# Altium schematic sheet SAMV71_Xplained_Ultra_Audio.SchDoc: Audio
size A3; Organization: Microchip Norway; Address1: Vestre Rosten 79; Address2: N-7075 TILLER; Address3: NORWAY; DocumentNumber: A09-2407; Revision: 12; SheetNumber: 11; SheetTotal: 13; DrawnBy: Microchip Norway; Engineer: AH; PageSetup: Record=PageOptions|CenterHorizontal=True|CenterVertical=True|PrintScale=1.01|XCorrection=1.00|YCorrection=1.00|PrintKind=1|BorderSize=5000000|LeftOffset=0|BottomOffset=0|Orientation=2|PaperLength=1000|PaperWidth=1000|Scale=100|PaperSource=7|PrintQuality=-4|MediaType=1|DitherType=10|PaperKind=A3 (297 x 420 mm)|PrintScaleMode=1; ProjectTitle: SAM V71 Xplained Ultra; PCBNumber: A08-2216; PCBRevision: 4
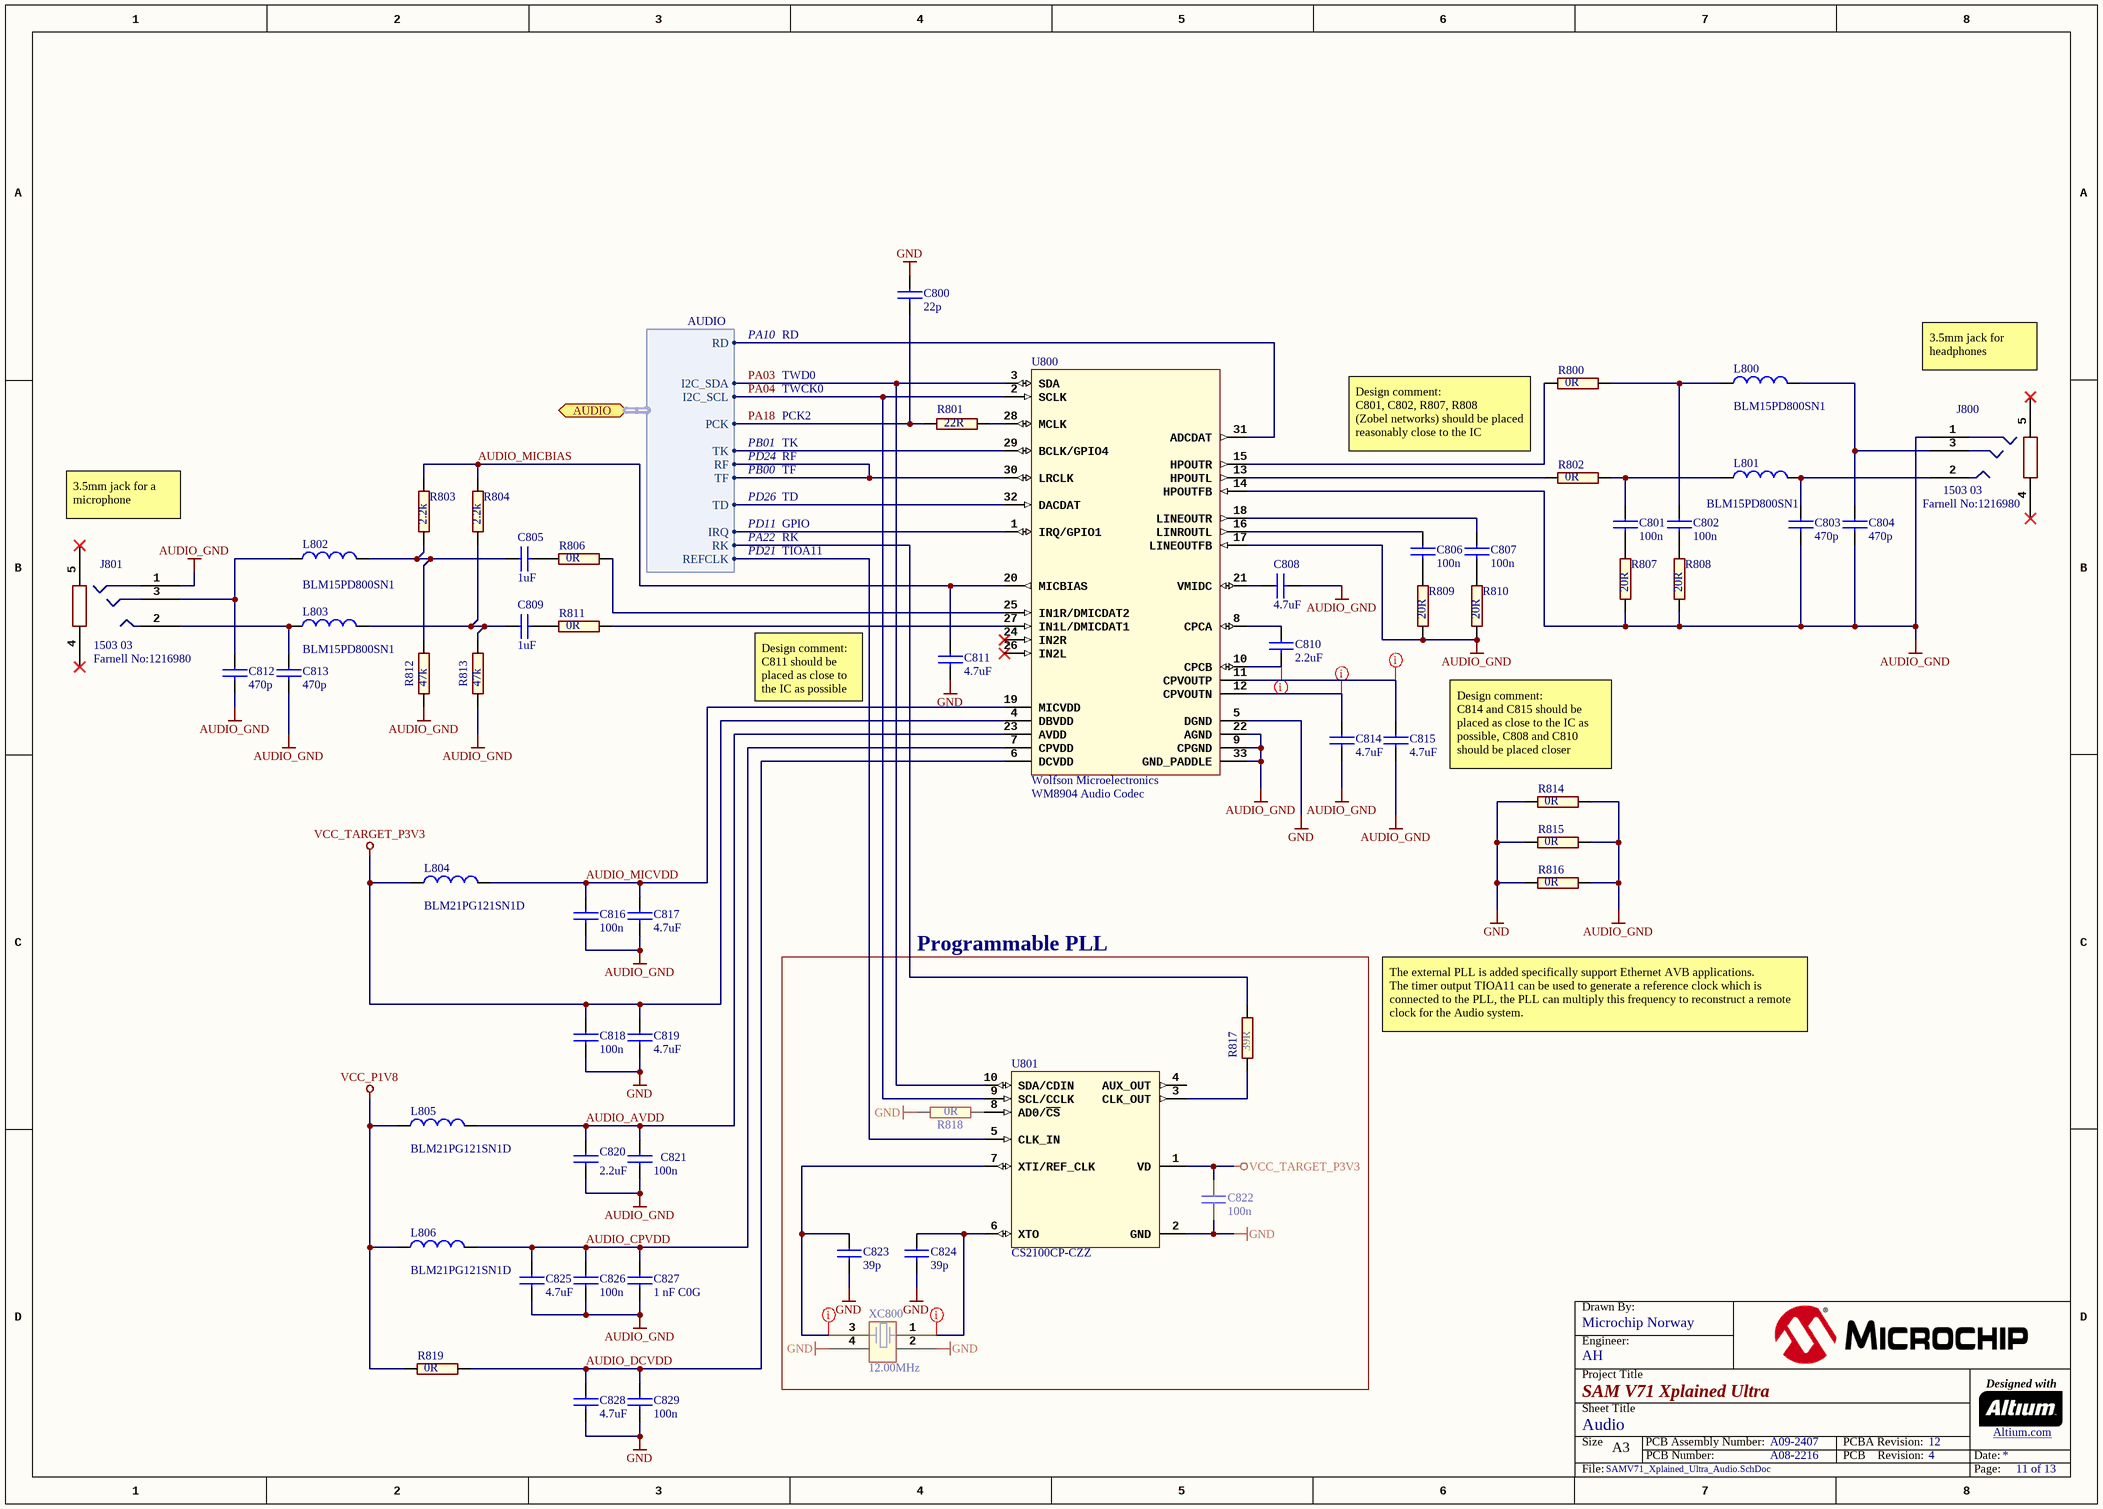
[diagram p0: SAMV71_Xplained_Ultra_Audio.SchDoc]

## Parts
C800  value 22p  [AP1-00001]
C801  value 100n  [AP1-00001]
C802  value 100n  [AP1-00001]
C803  value 470p  [AP1-00001]
C804  value 470p  [AP1-00001]
C805  value 1uF  [AP1-00038]
C806  value 100n  [AP1-00001]
C807  value 100n  [AP1-00001]
C808  value 4.7uF  [AP1-00039]
C809  value 1uF  [AP1-00038]
C810  value 2.2uF  [AP1-00001]  (hidden comment: Farnell no: 1288200)
C811  value 4.7uF  [AP1-00039]
C812  value 470p  [AP1-00001]
C813  value 470p  [AP1-00001]
C814  value 4.7uF  [AP1-00001]
C815  value 4.7uF  [AP1-00001]
C816  value 100n  [AP1-00001]
C817  value 4.7uF  [AP1-00039]
C818  value 100n  [AP1-00001]
C819  value 4.7uF  [AP1-00039]
C820  value 2.2uF  [AP1-00001]  (hidden comment: Farnell no: 1288200)
C821  value 100n  [AP1-00001]
C822  value 100n  [AP1-00001]
C823  value 39p  [AP1-00001]
C824  value 39p  [AP1-00001]
C825  value 4.7uF  [AP1-00039]
C826  value 100n  [AP1-00001]
C827  value 1 nF C0G  [AP1-00001]
C828  value 4.7uF  [AP1-00039]
C829  value 100n  [AP1-00001]
J800  Farnell No:1216980  value 1503 03  [AP8-00397]
J801  Farnell No:1216980  value 1503 03  [AP8-00397]
L800  value BLM15PD800SN1  [AP3-00028]
L801  value BLM15PD800SN1  [AP3-00028]
L802  value BLM15PD800SN1  [AP3-00028]
L803  value BLM15PD800SN1  [AP3-00028]
L804  value BLM21PG121SN1D  [AP3-00104]
L805  value BLM21PG121SN1D  [AP3-00104]
L806  value BLM21PG121SN1D  [AP3-00104]
R800  value 0R  [AP2-00000]
R801  value 22R  [AP2-00000]
R802  value 0R  [AP2-00000]
R803  value 2.2k  [AP2-00000]
R804  value 2.2k  [AP2-00000]
R806  value 0R  [AP2-00000]
R807  value 20R  [AP2-00000]
R808  value 20R  [AP2-00000]
R809  value 20R  [AP2-00000]
R810  value 20R  [AP2-00000]
R811  value 0R  [AP2-00000]
R812  value 47k  [AP2-00000]
R813  value 47k  [AP2-00000]
R814  value 0R  [AP2-00000]
R815  value 0R  [AP2-00000]
R816  value 0R  [AP2-00000]
R817  value 39R  [AP2-00000]
R818  value 0R  [AP2-00000]
R819  value 0R  [AP2-00000]
U800  Wolfson Microelectronics  value WM8904 Audio Codec  [AP6-00420]
U801  value CS2100CP-CZZ  [AP6-00097]
XC800  value 12.00MHz  [AP7-00039]

## Blocks framed on the sheet
Programmable PLL: C822-C824 R817 R818 U801 XC800

## Ports
AUDIO (harness AUDIO)

## Harnesses
AUDIO: I2C_SDA, I2C_SCL, PCK, TK, RK, TF, RD, TD, IRQ, REFCLK, RF

## Nets
AUDIO_GND: C803.2 C804.2 C808.2 C812.2 C813.2 C814.2 C815.2 C816.2 C817.2 C820.2 C821.2 C825.2 C826.2 C827.2 J800.1(GND) J801.1(GND) R807.1 R808.1 R809.1 R810.1 R812.1 R813.1 R814.2 R815.2 R816.2 U800.9(CPGND) U800.14(HPOUTFB) U800.17(LINEOUTFB) U800.22(AGND) U800.33(GND_PADDLE)
GND: C800.1 C811.2 C818.2 C819.2 C822.2 C823.2 C824.2 C828.2 C829.2 R814.1 R815.1 R816.1 R818.1 U800.5(DGND) U801.2(GND) XC800.2 XC800.4
VCC_P1V8: L805.1 L806.1 R819.1
VCC_TARGET_P3V3: C818.1 C819.1 C822.1 L804.1 U800.4(DBVDD) U801.1(VD)
AUDIO_AVDD: C820.1 C821.1 L805.2 U800.23(AVDD)
AUDIO_CPVDD: C825.1 C826.1 C827.1 L806.2 U800.7(CPVDD)
AUDIO_DCVDD: C828.1 C829.1 R819.2 U800.6(DCVDD)
AUDIO_MICBIAS: C811.1 R803.2 R804.2 U800.20(MICBIAS)
AUDIO_MICVDD: C816.1 C817.1 L804.2 U800.19(MICVDD)
PA03: U800.3(SDA) U801.10(SDA/CDIN) ; port AUDIO.I2C_SDA
PA04: U800.2(SCLK) U801.9(SCL/CCLK) ; port AUDIO.I2C_SCL
PA18: C800.2 R801.1 ; port AUDIO.PCK
NetC801_1: C801.1 L801.1 R802.2
NetC801_2: C801.2 R807.2
NetC802_1: C802.1 L800.1 R800.2
NetC802_2: C802.2 R808.2
NetC803_1: C803.1 J800.2 L801.2
NetC804_1: C804.1 J800.3 L800.2
NetC805_1: C805.1 L802.2 R803.1 R812.2
NetC805_2: C805.2 R806.1
NetC806_1: C806.1 U800.16(LINROUTL)
NetC806_2: C806.2 R809.2
NetC807_1: C807.1 U800.18(LINEOUTR)
NetC807_2: C807.2 R810.2
NetC808_1: C808.1 U800.21(VMIDC)
NetC809_1: C809.1 L803.2 R804.1 R813.2
NetC809_2: C809.2 R811.1
NetC810_1: C810.1 U800.8(CPCA)
NetC810_2: C810.2 U800.10(CPCB)
NetC812_1: C812.1 J801.3 L802.1
NetC813_1: C813.1 J801.2 L803.1
NetC814_1: C814.1 U800.12(CPVOUTN)
NetC815_1: C815.1 U800.11(CPVOUTP)
NetC823_1: C823.1 U801.7(XTI/REF_CLK) XC800.3
NetC824_1: C824.1 U801.6(XTO) XC800.1
NetR800_1: R800.1 U800.15(HPOUTR)
NetR801_2: R801.2 U800.28(MCLK)
NetR802_1: R802.1 U800.13(HPOUTL)
NetR806_2: R806.2 U800.25(IN1R/DMICDAT2)
NetR811_2: R811.2 U800.27(IN1L/DMICDAT1)
NetR817_1: R817.1 U801.3(CLK_OUT)
NetR817_2: R817.2 ; port AUDIO.RK
NetR818_2: R818.2 U801.8(AD0/~{CS})
NetU800_1: U800.1(IRQ/GPIO1) ; port AUDIO.IRQ
NetU800_29: U800.29(BCLK/GPIO4) ; port AUDIO.TK
NetU800_30: U800.30(LRCLK) ; port AUDIO.TF, port AUDIO.RF
NetU800_31: U800.31(ADCDAT) ; port AUDIO.RD
NetU800_32: U800.32(DACDAT) ; port AUDIO.TD
NetU801_5: U801.5(CLK_IN) ; port AUDIO.REFCLK

Not connected (* = marked no-connect by the designer): J800 4* 5*; J801 4* 5*; U800 24(IN2R)* 26(IN2L)*; U801 4(AUX_OUT)

## Layout directives
rule Assembly Testpoint Usage [Testpoint - Not Allowed    Multiple - Not Allowed]; rule Fabrication Testpoint Usage [Testpoint - Not Allowed    Multiple - Not Allowed]: NetC823_1, NetC824_1
rule Fabrication Testpoint Usage [Testpoint - Not Allowed    Multiple - Not Allowed]; rule Assembly Testpoint Usage [Testpoint - Not Allowed    Multiple - Not Allowed]: NetC810_2, NetC814_1, NetC815_1

## Notes on the sheet
- PA10
- RD
- TWD0
- 3.5mm jack for headphones
- PB01
- TWCK0
- PCK2
- TK
- Design comment:
  C801, C802, R807, R808
  (Zobel networks) should be placed reasonably close to the IC
- 3.5mm jack for a microphone
- PD24
- PB00
- PD26
- RF
- TF
- TD
- PA22
- PD21
- PD11
- GPIO
- RK
- TIOA11
- Design comment:
  C811 should be placed as close to the IC as possible
- Design comment:
  C814 and C815 should be placed as close to the IC as possible, C808 and C810 should be placed closer
- The external PLL is added specifically support Ethernet AVB applications.
  The timer output TIOA11 can be used to generate a reference clock which is
  connected to the PLL, the PLL can multiply this frequency to reconstruct a remote
  clock for the Audio system.
- Drawn By:
- Project Title
- Engineer:
- Designed with
- Sheet Title
- Size
- A3
- PCB Number:
- PCB Assembly Number:
- PCBA Revision:
- PCB    Revision:
- Date:
- Altium.com <http://go.altium.com/MicrochipLandingPage_Evaluation.html>
- File:
- Page:

## Library data of the parts
C800 = A01-0019: Ceramic capacitor, SMD 0402, NP0, 50V, +/-5%; PartGroup: Capacitors,Ceramic,SMD 0402; Manufacturer: YAGEO CORP; MPN: CC0402JRNPO9BN220; TemperatureRange: -55 - +125 deg C; AN: A01-0019; Tolerance: 50V, +/-5%; Height: 0,550000011920929
C801 C802 C806 C807 C816 C818 C821 C822 C826 C829 = A01-0246: Ceramic capacitor, SMD 0402, X7R, 16V, +/-10%; PartGroup: Capacitors,Ceramic,SMD 0402; Manufacturer: Kemet; MPN: C0402C104K4RACTU; TemperatureRange: -55 - +125 deg C; AN: A01-0246; Tolerance: 16V, +/-10%; Height: 0,5
C803 C804 C812 C813 = A01-0034: Ceramic capacitor, SMD 0402, X7R, 50V, +/-10%; PartGroup: Capacitors,Ceramic,SMD 0402; Manufacturer: Murata; MPN: GRM155R71H471KA01D; TemperatureRange: -55 - +125 deg C; AN: A01-0034; Tolerance: 50V, +/-10%; Height: 0,550000011920929
C805 C809 = A01-0447: Ceramic capacitor, SMD 0402, X5R, 10V, ±10 %; PartGroup: Capacitors,Ceramic,SMD 0402; Manufacturer: AVX; MPN: 0402ZD105KAT2A; AN: A01-0447; Height: 0,560000002384186
C808 C811 C817 C819 C825 C828 = A01-0377: Ceramic capacitor, SMD 0603, X5R, 10V, 10% (de31036); PartGroup: Capacitors,Ceramic,SMD 0603; Manufacturer: WALSIN Technology Corporation; MPN: 0603X475K100CT; TemperatureRange: -55 - +85 deg C; AN: A01-0377; Tolerance: 10%; Height: 0,800000011920929
C810 C820 = A01-0300: Ceramic capacitor, SMD 0402, X5R, 6.3V, +/-20%; PartGroup: Capacitors,Ceramic,SMD 0402; Manufacturer: Kemet; MPN: C0402C225M9PAC; Tolerance: Â±20%; TemperatureRange: -55Â°C to +85Â°C; AN: A01-0300; Height: 0,5
C814 C815 = A01-0347: Ceramic capacitor, SMD 0402, X5R, 6.3V, +/-20% (de33687); PartGroup: Capacitors,Ceramic,SMD 0402; Manufacturer: Murata; MPN: GRM155R60J475ME87D; Tolerance: +-20%; TemperatureRange: -55°C to +85°C; AN: A01-0347; Height: 0,5
C823 C824 = A01-0022: Ceramic capacitor, SMD 0402, NP0, 50V, +/-5%; PartGroup: Capacitors,Ceramic,SMD 0402; TemperatureRange: -55 - +125 deg C; AN: A01-0022; Tolerance: 50V, +/-5%; Height: 0,550000011920929
C827 = A01-0321: Ceramic capacitor, SMD 0402, C0G, 50V, +/-5%; PartGroup: Capacitors,Ceramic,SMD 0402; Manufacturer: Murata; MPN: GRM1555C1H102JA01D; Tolerance: 5%; AN: A01-0321; Height: 0,550000011920929
J800 J801 = A08-0886: 3.5mm stereo phone jack; PartGroup: Mechanical devices,Connectors,Other; Manufacturer: Lumberg; AN: A08-0886; Height: 5; MPN: 1503 03
L800-L803 = A03-0142: FERRITE CHIP 80 OHM 1500MA 0402; PartGroup: Inductors,EMI; Manufacturer: Murata; Tolerance: ±25%; TemperatureRange: -55 ° C to +125 ° C; AN: A03-0142; Height: 0,5; MPN: BLM15PD800SN1
L804-L806 = A03-0167: SMD EMI FERRITE 0805, Z=120 ohm(@100MHz), Max R(dc)=0.03 ohm, Max current=3A, (Digikey:490-5986-2-ND); PartGroup: Inductors,EMI; Manufacturer: Murata; TemperatureRange: -55 to +125Â°C; AN: A03-0167; Height: 0,899999976158142; MPN: BLM21PG121SN1D
R800 R802 R806 R811 R814-R816 R818 R819 = A02-0163: RES 0.0 OHM 1/16W 0402 SMD; PartGroup: Resistors,SMD,0402 1%; Manufacturer: (n/a); MPN: RMCF0402ZT0R00; Tolerance: 1 %; TemperatureRange: -55 - +125 deg C; AN: A02-0163; Height: 0,349999994039536
R801 = A02-0172: Thick film resistor, SMD 0402, 1/16W, 1% (de23607); PartGroup: Resistors,SMD,0402 1%; Manufacturer: Samsung; MPN: RC100SF22R0CS; TemperatureRange: -55 - +125 deg C; AN: A02-0172; Tolerance: 1 %; Height: 0,349999994039536
R803 R804 = A02-0220: Thick film resistor, SMD 0402, 1/16W, 1%; PartGroup: Resistors,SMD,0402 1%; Manufacturer: ASJ; MPN: CR10-2201-FK; TemperatureRange: -55 - +125 deg C; AN: A02-0220; Tolerance: 1 %; Height: 0,349999994039536
R807-R810 = A02-0171: Thick film resistor, SMD 0402, 1/16W, 1%; PartGroup: Resistors,SMD,0402 1%; Manufacturer: vishay; MPN: CRCW040220R0FKED; TemperatureRange: -55 - +125 deg C; AN: A02-0171; Tolerance: 1 %; Height: 0,349999994039536
R812 R813 = A02-0252: Thick film resistor, SMD 0402, 1/16W, 1%; PartGroup: Resistors,SMD,0402 1%; Manufacturer: KOA; MPN: RK73H1ETTP4702F; TemperatureRange: -55 - +125 deg C; AN: A02-0252; Tolerance: 1 %; Height: 0,349999994039536
R817 = A02-0178: Thick film resistor, SMD 0402, 1/16W, 1%; PartGroup: Resistors,SMD,0402 1%; Manufacturer: ASJ; MPN: CR10-39R0-FK; TemperatureRange: -55 - +125 deg C; AN: A02-0178; Tolerance: 1 %; Height: 0,349999994039536
U800 = A06-1156: Ultra Low Power Codec for Portable Audio Applications; PartGroup: Integrated Circuits,Special function,Mixed signal; MPN: WM8904CGEFL/RV; TemperatureRange: -40C to +85C; AN: A06-1156; Height: 0,800000011920929; Manufacturer: Wolfson microelectronics
U801 = A06-1177: Programmable Phase-Locked Loop Clock Generator; PartGroup: Integrated Circuits,Special function,Oscillator; Manufacturer: CIRRUS LOGIC; MPN: CS2100CP-CZZR; TemperatureRange: -10Â°C to +70Â°C; AN: A06-1177; Height: 1,10000002384186
XC800 = A07-0042: Fox FQ5032B 12.0MHz SMD crystal 738B-12; PartGroup: Frequency devices,Crystals,SMD; Manufacturer: Fox  Electronics; MPN: FQ5032B-12.000; Tolerance: Â±30ppm; TemperatureRange: 0Â°C ~ 70Â°C; AN: A07-0042; Height: 1,20000004768372